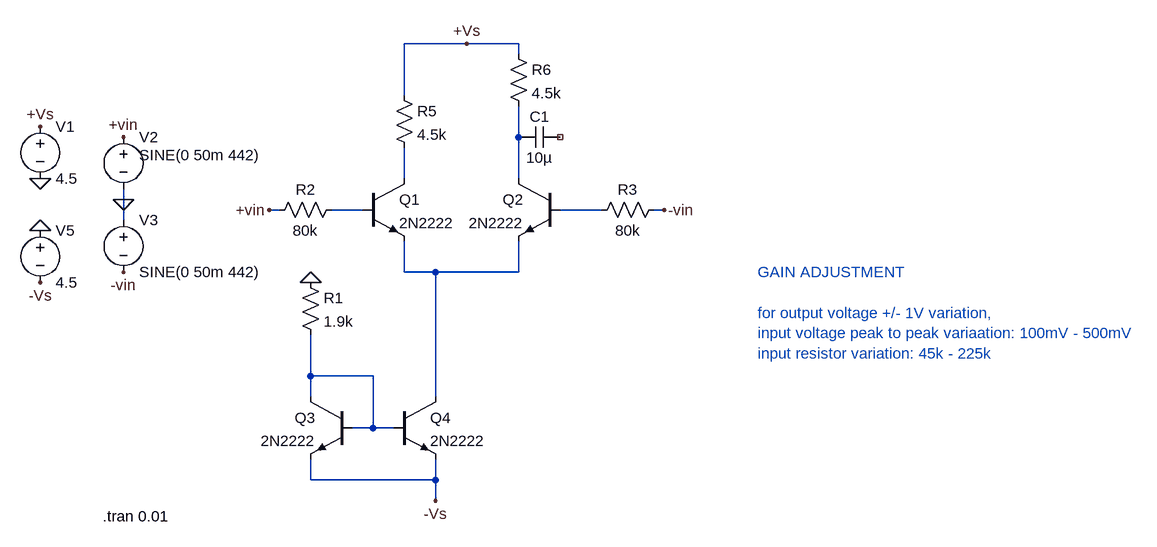
[diagram p0: schematic preamp_9vdual_supply_BJT_dif_amp.asc]
preamp_9vdual_supply_BJT_dif_amp.asc, the LTspice schematic file:
Version 4
SHEET 1 1384 680
WIRE 224 -128 128 -128
WIRE 304 -128 224 -128
WIRE 304 -112 304 -128
WIRE 128 -48 128 -128
WIRE 304 16 304 -32
WIRE 128 80 128 32
WIRE 304 80 304 16
WIRE -304 112 -304 96
WIRE -64 128 -80 128
WIRE 64 128 16 128
WIRE 432 128 368 128
WIRE 528 128 512 128
WIRE -304 144 -304 112
WIRE 128 224 128 176
WIRE 176 224 128 224
WIRE 304 224 304 176
WIRE 304 224 176 224
WIRE -16 384 -16 320
WIRE 80 384 -16 384
WIRE -16 416 -16 384
WIRE 176 416 176 224
WIRE 80 464 80 384
WIRE 80 464 48 464
WIRE 112 464 80 464
WIRE -16 544 -16 512
WIRE 176 544 176 512
WIRE 176 544 -16 544
WIRE 176 576 176 544
FLAG -432 80 0
FLAG -304 112 0
FLAG -304 16 +vin
FLAG -80 128 +vin
FLAG -304 224 -vin
FLAG 528 128 -vin
FLAG -432 0 +Vs
FLAG 224 -128 +Vs
FLAG -432 160 0
FLAG -432 240 -Vs
FLAG 176 576 -Vs
FLAG -16 240 0
SYMBOL npn 64 80 R0
SYMATTR InstName Q1
SYMATTR Value 2N2222
SYMBOL npn 368 80 M0
SYMATTR InstName Q2
SYMATTR Value 2N2222
SYMBOL npn 48 416 M0
SYMATTR InstName Q3
SYMATTR Value 2N2222
SYMBOL npn 112 416 R0
SYMATTR InstName Q4
SYMATTR Value 2N2222
SYMBOL res -32 224 R0
SYMATTR InstName R1
SYMATTR Value 1.9k
SYMBOL voltage -432 -16 R0
WINDOW 123 0 0 Left 0
WINDOW 39 0 0 Left 0
SYMATTR InstName V1
SYMATTR Value 4.5
SYMBOL voltage -304 0 R0
WINDOW 3 24 44 Left 2
WINDOW 123 0 0 Left 0
WINDOW 39 0 0 Left 0
SYMATTR InstName V2
SYMATTR Value SINE(0 50m 442)
SYMBOL voltage -304 128 R0
WINDOW 123 0 0 Left 0
WINDOW 39 0 0 Left 0
SYMATTR InstName V3
SYMATTR Value SINE(0 50m 442)
SYMBOL res 32 112 R90
WINDOW 0 0 56 VBottom 2
WINDOW 3 32 56 VTop 2
SYMATTR InstName R2
SYMATTR Value 80k
SYMBOL res 528 112 R90
WINDOW 0 0 56 VBottom 2
WINDOW 3 32 56 VTop 2
SYMATTR InstName R3
SYMATTR Value 80k
SYMBOL res 112 -64 R0
SYMATTR InstName R5
SYMATTR Value 4.5k
SYMBOL res 288 -128 R0
SYMATTR InstName R6
SYMATTR Value 4.5k
SYMBOL cap 368 0 R90
WINDOW 0 0 32 VBottom 2
WINDOW 3 32 32 VTop 2
SYMATTR InstName C1
SYMATTR Value 10µ
SYMBOL voltage -432 144 R0
WINDOW 123 0 0 Left 0
WINDOW 39 0 0 Left 0
SYMATTR InstName V5
SYMATTR Value 4.5
TEXT -336 600 Left 2 !.tran 0.01
TEXT 672 224 Left 2 ;GAIN ADJUSTMENT\n \nfor output voltage +/- 1V variation,\ninput voltage peak to peak variaation: 100mV - 500mV\ninput resistor variation: 45k - 225k

The netlist it stands for:
* preamp_9vdual_supply_BJT_dif_amp.asc
Q1 N002 N003 N005 0 2N2222
Q2 N001 N004 N005 0 2N2222
Q3 N006 N006 -Vs 0 2N2222
Q4 N005 N006 -Vs 0 2N2222
R1 0 N006 1.9k
V1 +Vs 0 4.5
V2 +vin 0 SINE(0 50m 442)
V3 0 -vin SINE(0 50m 442)
R2 N003 +vin 80k
R3 -vin N004 80k
R5 +Vs N002 4.5k
R6 +Vs N001 4.5k
C1 NC_01 N001 10µ
V5 0 -Vs 4.5
.model NPN NPN
.model PNP PNP
.lib standard.bjt
.tran 0.01
* GAIN ADJUSTMENT
* for output voltage +/- 1V variation,
* input voltage peak to peak variaation: 100mV - 500mV
* input resistor variation: 45k - 225k
.backanno
.end